# EAGLE design arduino_Uno_Rev3-02-TH (EAGLE 7.5.0)
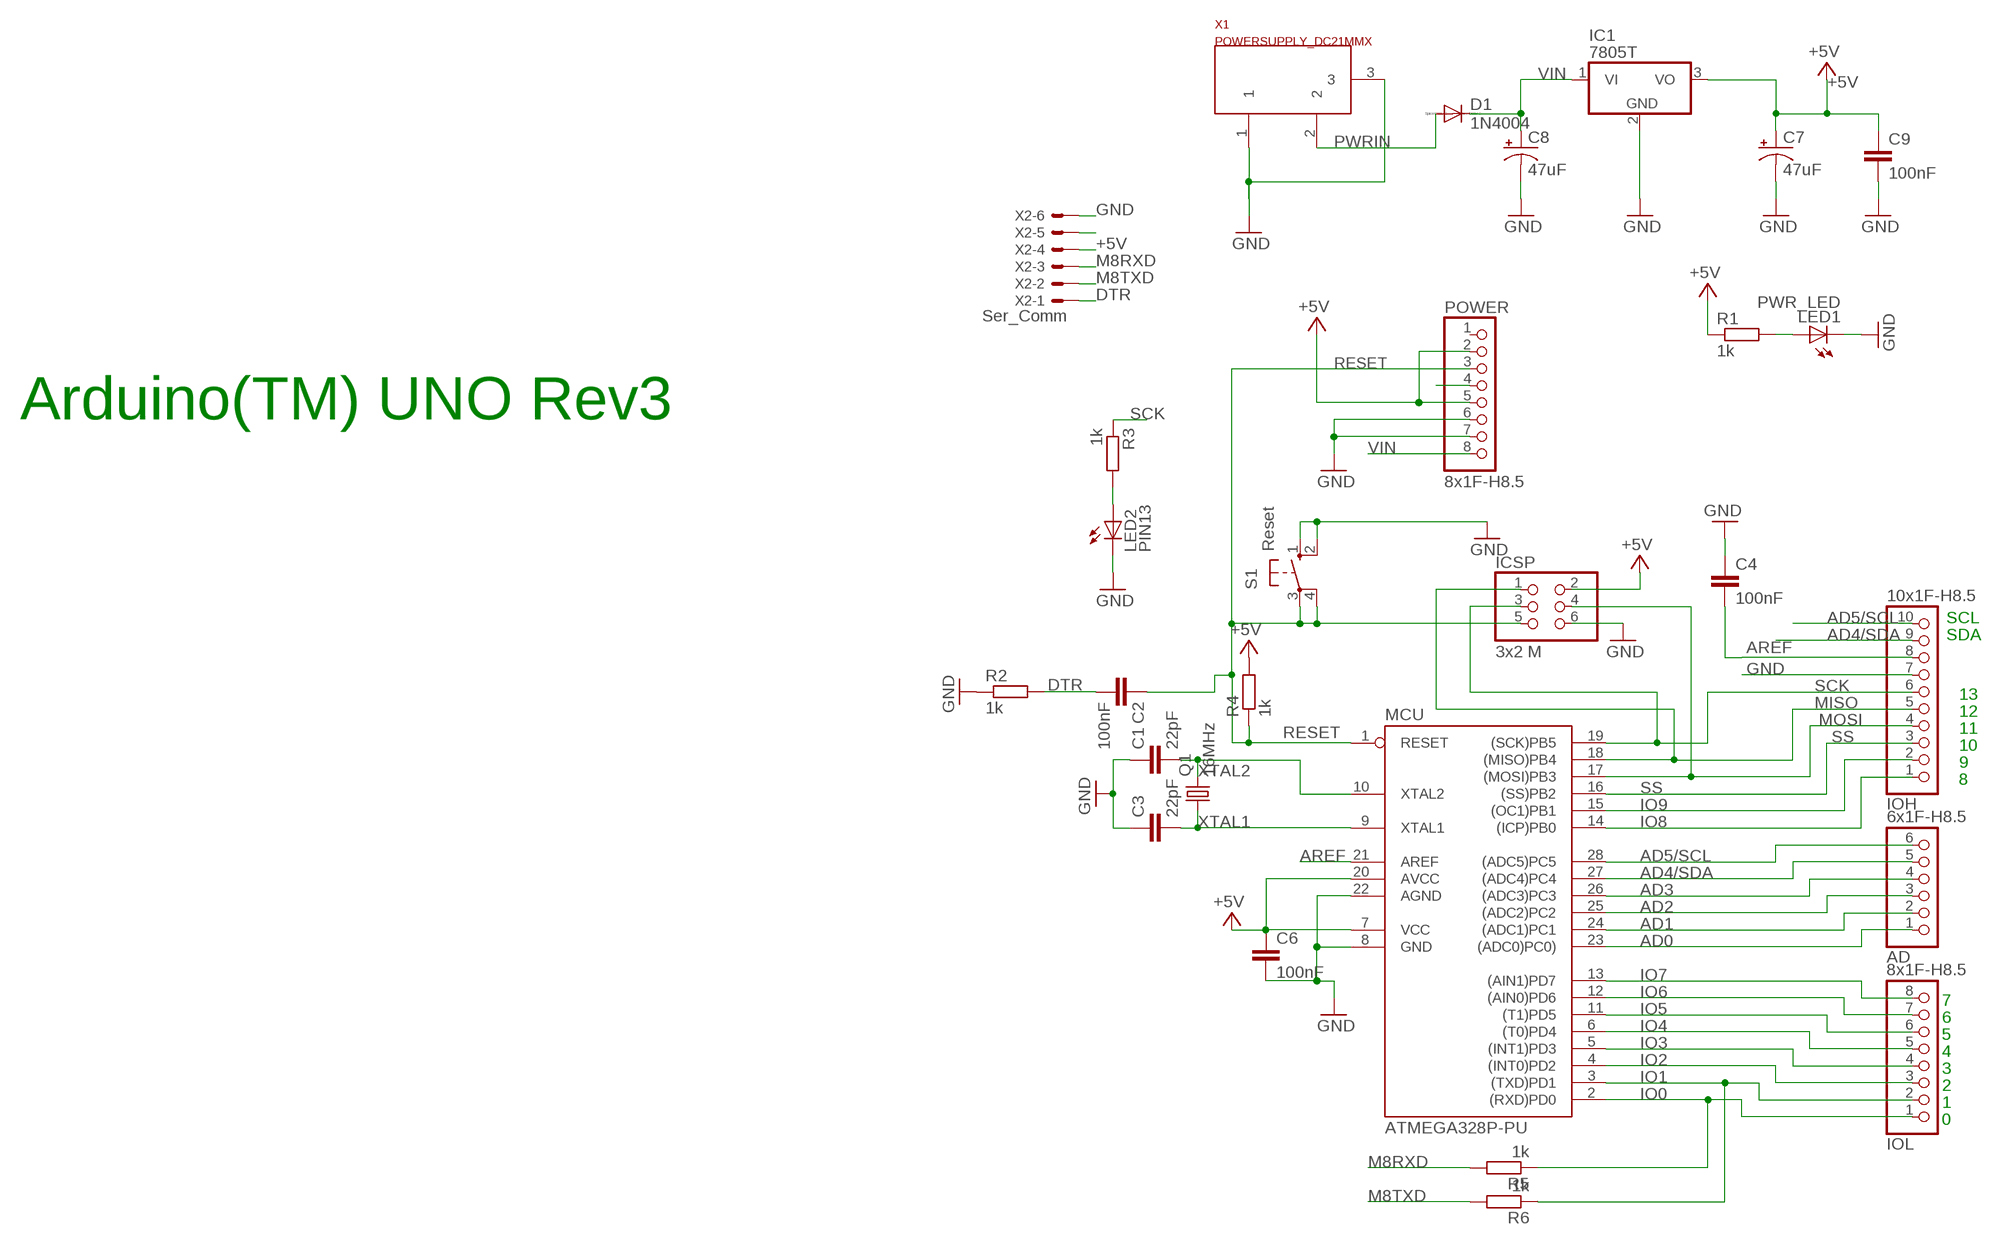
[diagram p0: schematic, sheet 1]

## Parts
AD  6x1F-H8.5  PINHD-1X6  [1X06]
C1  22pF  C2.5/2  [C2.5-2]
C2  100nF  C2,5-3  [C2.5-3]
C3  22pF  C2.5/2  [C2.5-2]
C4  100nF  C2,5-3  [C2.5-3]
C6  100nF  C2,5-3  [C2.5-3]
C7  47uF  CPOL-USE3.5-8  [E3,5-8]
C8  47uF  CPOL-USE3.5-8  [E3,5-8]
C9  100nF  C2,5-3  [C2.5-3]
D1  1N4004  [DO41-10]
IC1  7805T  [TO220H]
ICSP  3x2 M  PINHD-2X3  [2X03]
IOH  10x1F-H8.5  PINHD-1X10_ARD  [1X10]
IOL  8x1F-H8.5  PINHD-1X8  [1X08]
LED1  PWR_LED  LED3MM  [LED3MM]
LED2  PIN13  LED5MM  [LED5MM]
MCU  ATMEGA328P-PU  [DIL28-3]
POWER  8x1F-H8.5  PINHD-1X8  [1X08]
Q1  16MHz  CRYSTALHC49S  [HC49/S]
R1  1k  R-EU_0207/10  [0207/10]
R2  1k  R-EU_0207/10  [0207/10]
R3  1k  R-EU_0207/10  [0207/10]
R4  1k  R-EU_0207/10  [0207/10]
R5  1k  R-EU_0207/10  [0207/10]
R6  1k  R-EU_0207/10  [0207/10]
S1  Reset  10-XX  [B3F-10XX]
X1  POWERSUPPLY_DC21MMX  [POWERSUPPLY_DC-21MM]
X2  Ser_Comm  22-23-2061  [22-23-2061]

## Nets
+5V [usbvcc]: C6.1 C7.+ C9.1 IC1.3(VO) ICSP.2 MCU.7(VCC) MCU.20(AVCC) POWER.2 POWER.5 R1.1 R4.2 X2.4
AD0: AD.1 MCU.23((ADC0)PC0))
AD1: AD.2 MCU.24((ADC1)PC1)
AD2: AD.3 MCU.25((ADC2)PC2)
AD3: AD.4 MCU.26((ADC3)PC3)
AD4/SDA: AD.5 IOH.9 MCU.27((ADC4)PC4)
AD5/SCL: AD.6 IOH.10 MCU.28((ADC5)PC5)
AREF [aref]: C4.2 IOH.8 MCU.21(AREF)
DTR: C2.2 R2.2 X2.1
GND [gnd]: C1.1 C3.1 C4.1 C6.2 C7.- C8.- C9.2 IC1.2(GND) ICSP.6 IOH.7 LED1.K(C) LED2.K(C) MCU.8(GND) MCU.22(AGND) POWER.6 POWER.7 R2.1 S1.1(S) S1.2(S1) X1.1 X1.3 X2.6
IO0: IOL.1 MCU.2((RXD)PD0) R5.1
IO1: IOL.2 MCU.3((TXD)PD1) R6.1
IO2: IOL.3 MCU.4((INT0)PD2)
IO3: IOL.4 MCU.5((INT1)PD3)
IO4: IOL.5 MCU.6((T0)PD4)
IO5: IOL.6 MCU.11((T1)PD5)
IO6: IOL.7 MCU.12((AIN0)PD6)
IO7: IOL.8 MCU.13((AIN1)PD7)
IO8: IOH.1 MCU.14((ICP)PB0)
IO9: IOH.2 MCU.15((OC1)PB1)
M8RXD: R5.2 X2.3
M8TXD: R6.2 X2.2
MISO: ICSP.1 IOH.5 MCU.18((MISO)PB4)
MOSI: ICSP.4 IOH.4 MCU.17((MOSI)PB3)
N$1: POWER.4
N$2: LED2.A R3.2
N$3: LED1.A R1.2
N$8: X2.5
PWRIN [power]: D1.A X1.2
RESET: C2.1 ICSP.5 MCU.1(RESET) POWER.3 R4.1 S1.3(P) S1.4(P1)
SCK: ICSP.3 IOH.6 MCU.19((SCK)PB5) R3.1
SS: IOH.3 MCU.16((SS)PB2)
VIN [power]: C8.+ D1.C IC1.1(VI) POWER.8
XTAL1: C3.2 MCU.9(XTAL1) Q1.1
XTAL2: C1.2 MCU.10(XTAL2) Q1.2
Unconnected: POWER.1

## Notes on the sheet
- Arduino(TM) UNO Rev3
- SCL
- SDA
- 13
- 12
- 11
- 10
- 9
- 8
- 7
- 6
- 5
- 4
- 3
- 2
- 1
- 0

## Library data of the parts
AD = SmartPrj:PINHD-1X6: PIN HEADER
C1-C4 C6 C9 = capacitor-wima:C: CAPACITOR naming: grid - package width
C7 C8 = rcl:CPOL-US: POLARIZED CAPACITOR, American symbol
D1 = diode:1N4004: DIODE general purpose rectifier, 1 A
IC1 = linear:78*: Positive VOLTAGE REGULATOR Source: http://cache.national.com/ds/LM/LM78L05.pdf http://www.fairchildsemi.com/ds/LM/LM7805.pdf
ICSP = SmartPrj:PINHD-2X3: PIN HEADER
IOH = SmartPrj:PINHD-1X10_ARD: PIN HEADER
IOL POWER = SmartPrj:PINHD-1X8: PIN HEADER
LED1 LED2 = led:LED: LED OSRAM: - CHIPLED LG R971, LG N971, LY N971, LG Q971, LY Q971, LO R971, LY R971 LH N974, LH R974 LS Q976, LO Q976, LY Q976 LO Q996 - Hyper CHIPLED LW Q18S LB Q993, LB Q99A, LB R99A - SideLED LS A670, LO A670, LY A670, LG A670, LP A670 LB A673, LV A673, LT A673, LW A673 LH A674 LY A675 LS A676, LA A676, LO A676, LY A676, LW A676 LS A679, LY A679, LG A679 - Hyper Micro SIDELED® LS Y876, LA Y876, LO Y876, LY Y876 LT Y87S - SmartLED LW L88C, LW L88S LB L89C, LB L89S, LG L890 LS L89K, LO L89K, LY L89K LS L896, LA L896, LO L896, LY L896 - TOPLED LS T670, LO T670, LY T670, LG T670, LP T670 LSG T670, LSP T670, LSY T670, LOP T670, LYG T670 LG T671, LOG T671, LSG T671 LB T673, LV T673, LT T673, LW T673 LH T674 LS T676, LA T676, LO T676, LY T676, LB T676, LH T676, LSB T676, LW T676 LB T67C, LV T67C, LT T67C, LS T67K, LO T67K, LY T67K, LW E67C LS E67B, LA E67B, LO E67B, LY E67B, LB E67C, LV E67C, LT E67C LW T67C LS T679, LY T679, LG T679 LS T770, LO T770, LY T770, LG T770, LP T770 LB T773, LV T773, LT T773, LW T773 LH T774 LS E675, LA E675, LY E675, LS T675 LS T776, LA T776, LO T776, LY T776, LB T776 LHGB T686 LT T68C, LB T68C - Hyper Mini TOPLED® LB M676 - Mini TOPLED Santana® LG M470 LS M47K, LO M47K, LY M47K Source: http://www.osram.convergy.de LUXEON: - LUMILED® LXK2-PW12-R00, LXK2-PW12-S00, LXK2-PW14-U00, LXK2-PW14-V00 LXK2-PM12-R00, LXK2-PM12-S00, LXK2-PM14-U00 LXK2-PE12-Q00, LXK2-PE12-R00, LXK2-PE12-S00, LXK2-PE14-T00, LXK2-PE14-U00 LXK2-PB12-K00, LXK2-PB12-L00, LXK2-PB12-M00, LXK2-PB14-N00, LXK2-PB14-P00, LXK2-PB14-Q00 LXK2-PR12-L00, LXK2-PR12-M00, LXK2-PR14-Q00, LXK2-PR14-R00 LXK2-PD12-Q00, LXK2-PD12-R00, LXK2-PD12-S00 LXK2-PH12-R00, LXK2-PH12-S00 LXK2-PL12-P00, LXK2-PL12-Q00, LXK2-PL12-R00 Source: www.luxeon.com KINGBRIGHT: KA-3528ASYC Source: www.kingbright.com
MCU = SmartPrj:ATMEGA328P-: MICROCONTROLLER 4 Kbytes FLASH 128 bytes SRAM 256 bytes EEPROM UART 6-channel 10 bit ADC
Q1 = crystal:CRYSTAL: CRYSTAL; OC_FARNELL: 1667008; OC_NEWARK: unknown
R1-R6 = rcl:R-EU_: RESISTOR, European symbol
S1 = switch-omron:10-XX: OMRON SWITCH; MPN: B3F-1000; OC_FARNELL: 176432; OC_NEWARK: 36M3542
X1 = SmartPrj:POWERSUPPLY_DC21MM
X2 = con-molex:22-23-2061: .100" (2.54mm) Center Header - 6 Pin; MF: MOLEX; MPN: 22-23-2061; OC_FARNELL: 1462922; OC_NEWARK: 27C1933

## Net classes
0 default: width 0.254 mm, clearance 0.254 mm
1 power: width 0.61 mm, drill 0.61 mm, clearance 0.254 mm
2 gnd: width 0.305 mm, drill 0.559 mm, clearance 0.254 mm
3 usbvcc: width 0.508 mm, drill 0.61 mm, clearance 0.254 mm
4 aref: width 0.406 mm, drill 0.61 mm, clearance 0.254 mm

## Board
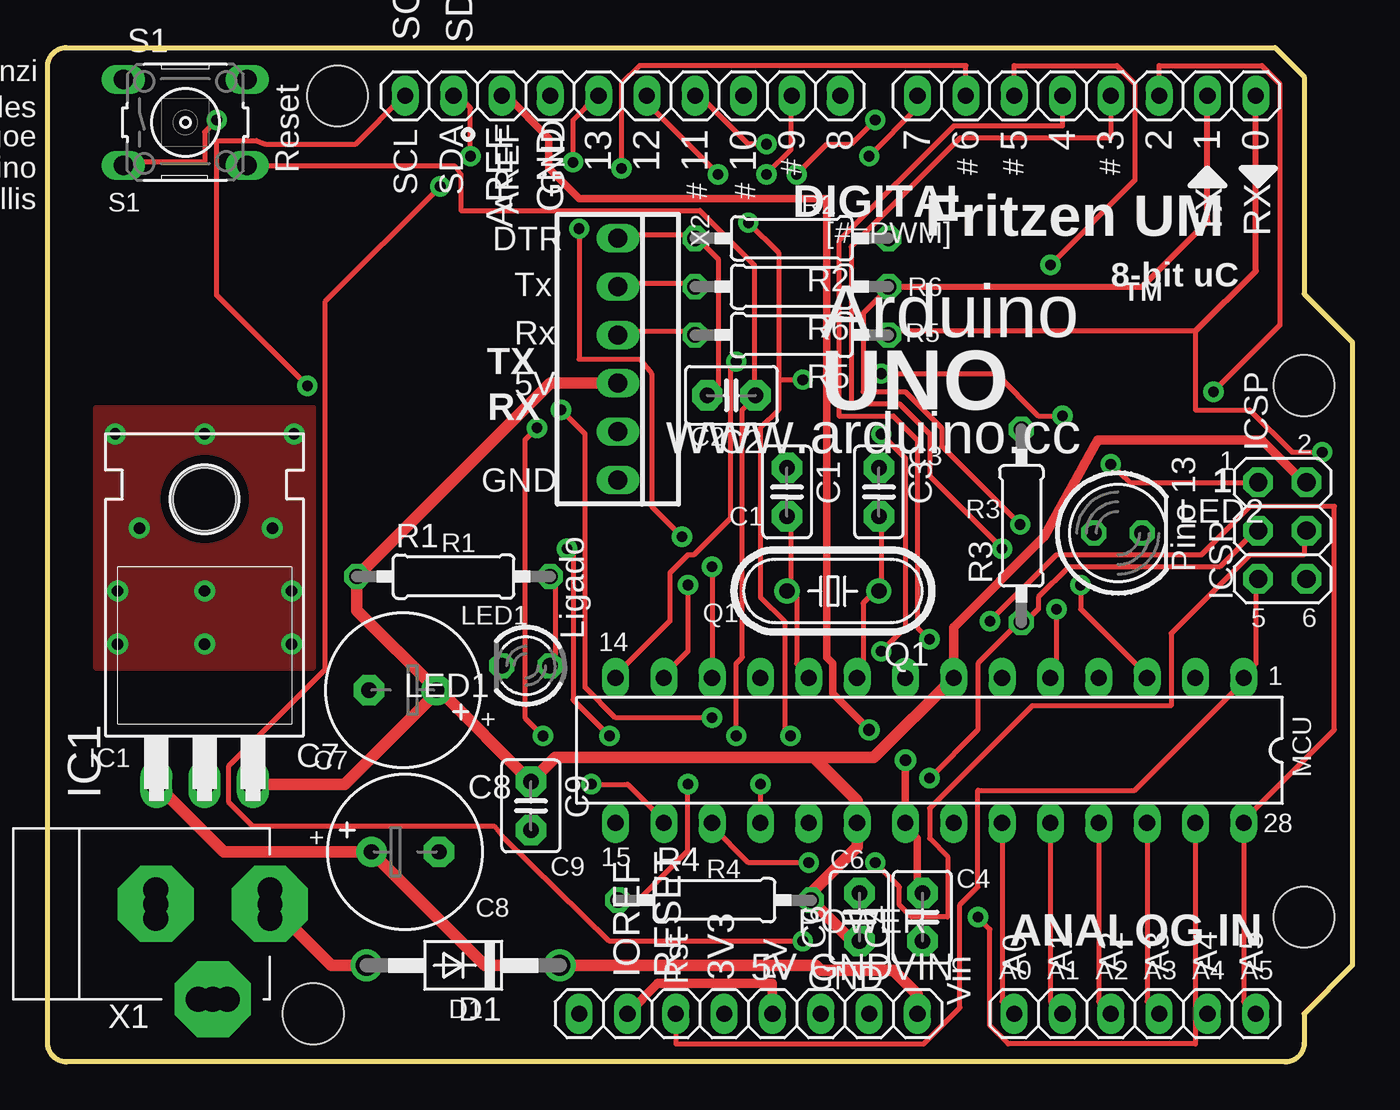
[diagram p1: board, top side]
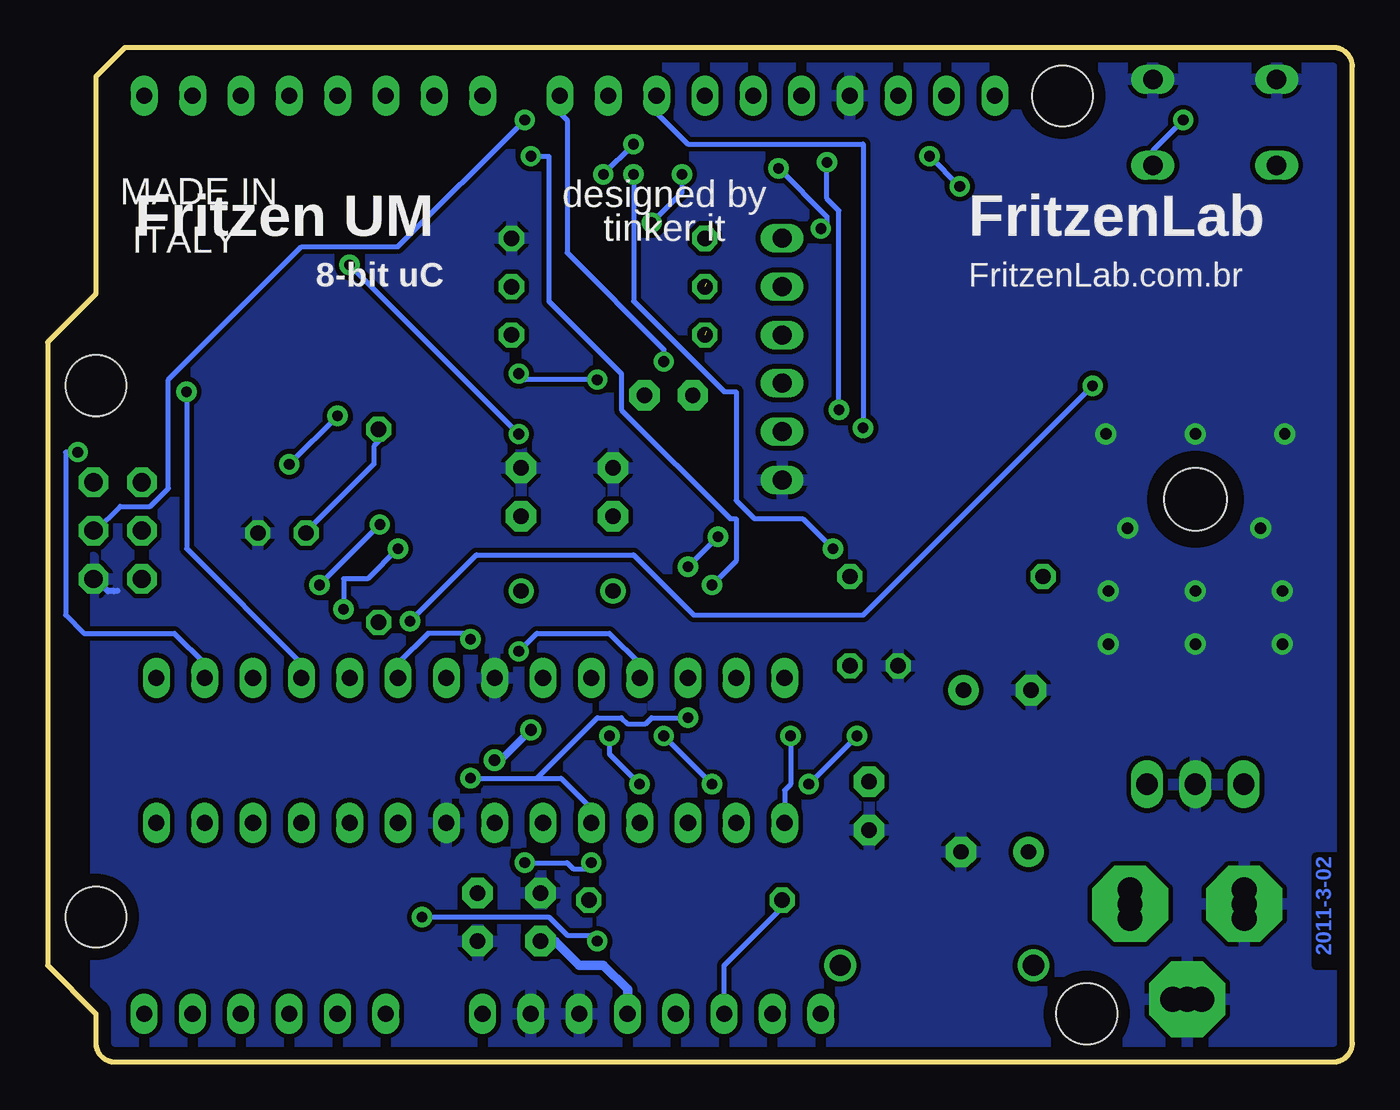
[diagram p2: board, bottom side, seen from below]

Size 68.58 x 53.34 mm. Coordinates in mm from the lower left corner, seen from the top.
Outline: 64.52,53.34 66.04,51.82 66.04,40.39 68.58,37.85 68.58,5.08 66.04,2.54 66.04,1 arc-90 65.04,0 1,0 arc-90 0,1 0,52.34 arc-90 1,53.34 64.52,53.34
Copper layers (1*16): Top 0.035mm / dielectric 1.5mm / Bottom 0.035mm
Design rules "default *": minimum track width 10mil, minimum drill 22mil, track to track 10mil, track to pad 10mil, pad to pad 10mil, via to via 10mil, smd to smd 8mil, copper to edge 26mil, drill to drill 10mil, minimum pad ring 10mil, minimum via ring 10mil, stop-mask expansion 1mil, vias tented up to drill 30mil, thermal gap 10mil
Holes 3.2 mm at 66.04,35.56 66.04,7.62 15.24,50.8 13.97,2.54
vRestrict: area 22.9,44.1 to 24.6,49.1; area 25.4,45.5 to 27.1,49.1; area 28.4,45.3 to 29.6,48.8; area 31,45.3 to 32.1,48.8; area 33.5,45.3 to 34.7,48.8; area 36.1,45.3 to 37.2,48.8; area 38.7,47.2 to 39.9,48.8; area 40.3,45.1 to 47.6,46.9; area 60.3,44.2 to 61.7,46.7; area 62.9,44.2 to 64.3,46.7; area 61.3,35.8 to 64.8,37.2; area 0.6,21.8 to 2,30.1; 14 more areas

### Footprints (pad centres in the part's own frame; a part is rotated, then mirrored left to right if it is on the bottom)
1X06 = drill 0.85 pad 1.422 long: 1 -6.35,0; 2 -3.81,0; 3 -1.27,0; 4 1.27,0; 5 3.81,0; 6 6.35,0
C2.5-2 = drill 0.813 pad 1.6 octagon: 1 -1.27,0; 2 1.27,0
C2.5-3 = drill 0.813 pad 1.6 octagon: 1 -1.27,0; 2 1.27,0
E3,5-8 = drill 0.813 pad 1.6: + -1.778,0 | drill 0.813 pad 1.6 octagon: - 1.778,0
DO41-10 = drill 1.118: A 5.08,0; C -5.08,0
TO220H = drill 1.118 long: 1 -2.54,-10.16; 2 0,-10.16; 3 2.54,-10.16 | hole 3.302: 0,4.826
2X03 = drill 0.95 pad 1.55 octagon: 1 -2.54,-1.27; 2 -2.54,1.27; 3 0,-1.27; 4 0,1.27; 5 2.54,-1.27; 6 2.54,1.27
1X10 = drill 0.85 pad 1.422 long: 1 -11.43,0; 2 -8.89,0; 3 -6.35,0; 4 -3.81,0; 5 -1.27,0; 6 1.27,0; 7 3.81,0; 8 6.35,0; 9 8.89,0; 10 11.43,0
1X08 = drill 0.85 pad 1.422 long: 1 -8.89,0; 2 -6.35,0; 3 -3.81,0; 4 -1.27,0; 5 1.27,0; 6 3.81,0; 7 6.35,0; 8 8.89,0
LED3MM = drill 0.813 octagon: A -1.27,0; K 1.27,0
LED5MM = drill 0.813 octagon: A -1.27,0; K 1.27,0
DIL28-3 = drill 0.85 pad 1.422 long: 1 -16.51,-3.81; 2 -13.97,-3.81; 3 -11.43,-3.81; 4 -8.89,-3.81; 5 -6.35,-3.81; 6 -3.81,-3.81; 7 -1.27,-3.81; 8 1.27,-3.81; 9 3.81,-3.81; 10 6.35,-3.81; 11 8.89,-3.81; 12 11.43,-3.81; 13 13.97,-3.81; 14 16.51,-3.81; 15 16.51,3.81; 16 13.97,3.81; 17 11.43,3.81; 18 8.89,3.81; 19 6.35,3.81; 20 3.81,3.81; 21 1.27,3.81; 22 -1.27,3.81; 23 -3.81,3.81; 24 -6.35,3.81; 25 -8.89,3.81; 26 -11.43,3.81; 27 -13.97,3.81; 28 -16.51,3.81
HC49/S = drill 0.813: 1 -2.413,0; 2 2.413,0
0207/10 = drill 0.813 octagon: 1 -5.08,0; 2 5.08,0
B3F-10XX = drill 1.016 long: 1 -3.251,2.261; 2 3.251,2.261; 3 -3.251,-2.261; 4 3.251,-2.261
POWERSUPPLY_DC-21MM = drill 1.3 pad 4 octagon: 1 -5.08,-3.353; 2 -0.076,-6.35; 3 -0.076,-0.356 | drill 1.3: 4 -5.08,-4.115; 5 -5.08,-2.591; 6 -0.838,-0.356; 7 0.686,-0.356; 8 -0.838,-6.35; 9 0.686,-6.35
22-23-2061 = drill 1 long: 1 -6.35,0; 2 -3.81,0; 3 -1.27,0; 4 1.27,0; 5 3.81,0; 6 6.35,0

### Placement (x,y rotation side)
AD  57.15,2.54 0 top
C1  38.86,29.97 270 top
C2  35.94,35.05 180 top
C3  43.69,29.97 270 top
C4  45.97,7.62 90 top
C6  42.67,7.62 90 top
C7  18.67,19.56 180 top
C8  18.8,11.05 0 top
C9  25.4,13.46 270 top
D1  21.84,5.08 180 top
IC1  8.26,24.77 0 top
ICSP  64.9,27.94 270 top
IOH  30.23,50.8 180 top
IOL  54.61,50.8 180 top
LED1  25.15,20.83 180 top
LED2  56.26,27.81 0 top
MCU  46.35,16.38 180 top
POWER  36.83,2.54 0 top
Q1  41.27,24.77 180 top
R1  21.34,25.53 0 top
R2  39.12,43.31 180 top
R3  51.18,28.19 90 top
R4  35.05,8.51 0 top
R5  39.12,38.23 180 top
R6  39.12,40.77 180 top
S1  7.24,49.4 0 top
X1  5.33,8.38 90 top
X2  29.97,36.96 270 top

### Tracks (layer width: path | path; a pad name or v marks a point on that pad's centre or on a via)
+5V
  Top 0.508: POWER.2 32.07,4.13 38.1,4.13 POWER.5 | MCU.7 47.62,22.86 52.39,27.62 55.18,32.7 63.82,32.7 66.04,30.48 ICSP.2
  Top 0.61: IC1.3 15.62,14.61 20.45,19.43 C7.+ | C7.+ 16.26,23.75 R1.1 26.42,35.69 X2.4 | C7.+ 20.57,19.56 C9.1 26.67,16 40.26,16 | 40.26,16 42.55,13.72 MCU.20 42.55,11.3 40.13,8.89 R4.2 42.29,6.35 C6.1 | MCU.7 43.43,16 40.26,16
  Bottom 0.508: POWER.5 38.1,3.81 39.37,5.08 40.64,5.08 41.91,6.35 C6.1
AD0
  Top 0.254: AD.1 50.16,3.17 MCU.23
AD1
  Top 0.254: AD.2 52.7,3.17 MCU.24
AD2
  Top 0.254: AD.3 55.24,3.17 MCU.25
AD3
  Top 0.254: AD.4 57.78,3.17 MCU.26
AD4/SDA  (via drill 0.56)
  Top 0.254: MCU.27 60.33,3.17 | v22.23,47.62 22.23,50.16 21.59,50.8 IOH.9 | v20.64,46.04 14.61,40.01 14.61,20.64 9.53,15.56 9.53,13.65 10.79,12.38 23.5,12.38 24,11.75 29.53,6.35 v39.69,6.35 | v48.9,7.62 49.53,6.99 49.53,1.91 50.48,0.95 60.33,0.95 60.33,3.17 | 60.33,3.17 AD.5
  Bottom 0.254: v20.64,46.04 v22.23,47.62 | v39.69,6.35 40.01,6.67 41.27,6.67 42.23,7.62 v48.9,7.62
AD5/SCL  (via drill 0.56)
  Top 0.254: AD.6 62.87,3.17 MCU.28 62.87,12.7 67.63,17.46 67.63,29.21 63.18,29.21 60.64,26.67 53.02,26.67 v49.53,23.18 | v13.65,35.56 8.89,40.32 8.89,48.45 10.99,48.45 11.43,48.26 16.19,48.26 18.73,50.8 IOH.10
  Bottom 0.254: v13.65,35.56 25.72,23.5 34.61,23.5 37.78,26.67 46.04,26.67 v49.53,23.18
AREF  (via drill 0.61)
  Top 0.406: C4.2 45.72,8.89 45.72,11.75 45.09,12.38 MCU.21 v45.09,15.88 | v43.18,17.46 41.27,19.37 41.27,20.95 40.96,21.27 40.96,45.4 27.94,45.4 26.35,46.99 26.35,48.58 24.13,50.8 IOH.8
  Bottom 0.406: v43.18,17.46 44.77,15.88 v45.09,15.88
DTR
  Top 0.254: X2.1 30.16,43.5 33.97,43.5 R2.2 34.29,43.18 35.24,42.23 35.24,35.56 34.92,35.24 C2.2
GND  (via drill 0.6)
  Bottom 0.305: ICSP.6 66.04,25.4 65.41,24.77 65.09,24.77 64.9,24.78
  other vias: 8.26,21.97 12.83,21.97 3.68,21.97 3.68,24.77 8.26,24.77 12.83,24.77 11.81,28.07 4.83,28.07 12.95,33.02 8.26,33.02 3.56,33.02
  pour Bottom: 0,53.34 66.04,53.34 66.04,39.24 66.04,22.23 66.04,4.95 66.04,0.13 55.63,0.13 42.55,0.13 31.11,0.13 19.18,0.13 9.78,0.13 0,0.13 0,0.89 0,12.06 0,21.84 0,30.99 0,38.35 0,47.12
  pour Top: 13.97,20.7 2.54,20.7 2.54,30.73 2.54,34.42 13.97,34.42 13.97,33.02 13.97,23.88
IO0  (via drill 0.56)
  Top 0.254: R5.1 44.45,38.42 60.33,38.42 60.33,34.29 63.18,34.29 65.41,32.07 v66.99,32.07
  Top 0.305: 60.33,38.42 63.5,41.59 IOL.1
  Bottom 0.254: MCU.2 60.33,20.95 61.91,22.54 66.67,22.54 67.63,23.5 67.63,32.07 v66.99,32.07
IO1  (via drill 0.56)
  Top 0.254: v54.29,25.08 54.29,23.81 57.78,20.32 MCU.3 | v51.12,28.26 46.99,32.38 46.99,33.34 45.09,35.24 42.86,35.24 42.86,39.37 44.13,40.64 R6.1
  Top 0.305: R6.1 57.53,40.77 60.96,44.2 IOL.2
  Bottom 0.254: v51.12,28.26 v54.29,25.08
IO2  (via drill 0.56)
  Top 0.254: v61.28,35.24 64.77,38.73 64.77,51.44 63.82,52.39 58.42,52.39 IOL.3
  Bottom 0.254: MCU.4 55.24,20.95 61.28,26.99 v61.28,35.24
IO3  (via drill 0.56)
  Top 0.254: v53.02,23.81 53.02,20.64 52.7,20.32 MCU.5 | v50.16,26.99 46.35,30.8 46.35,33.02 44.77,34.61 42.23,34.61 42.23,42.86 47.94,48.58 55.88,48.58 IOL.4
  Bottom 0.254: v53.02,23.81 53.02,25.4 51.75,25.4 v50.16,26.99
IO4  (via drill 0.56)
  Top 0.254: v46.35,22.23 45.72,22.86 45.72,32.7 44.45,33.97 41.59,33.97 41.59,43.18 47.62,49.21 53.34,49.21 IOL.5
  Bottom 0.254: MCU.6 50.16,20.95 48.58,22.54 46.67,22.54 v46.35,22.23
IO5  (via drill 0.56)
  Top 0.254: v43.81,21.59 45.09,22.86 45.09,31.75 v43.81,33.02 | v52.7,41.91 57.15,46.35 57.15,51.44 56.2,52.39 50.8,52.39 IOL.6
  Bottom 0.254: MCU.11 37.47,20.95 39.05,22.54 42.86,22.54 v43.81,21.59 | v52.7,41.91 v43.81,33.02
IO6  (via drill 0.56)
  Top 0.254: v34.92,26.04 MCU.12 | v33.34,27.62 31.75,29.21 31.75,36.2 31.11,36.96 27.94,36.96 v27.94,43.81 | v30.16,46.99 30.16,51.44 31.11,52.39 48.26,52.39 IOL.7
  Bottom 0.254: v33.34,27.62 v34.92,26.04 | v27.94,43.81 27.62,44.13 27.62,44.45 v30.16,46.99
IO7  (via drill 0.56)
  Top 0.254: v33.66,25.08 33.66,21.59 32.38,20.32 MCU.13 | v43.18,47.62 45.72,50.16 IOL.8
  Bottom 0.254: v33.66,25.08 32.38,26.35 32.38,28.57 32.7,28.57 38.42,34.29 38.42,36.2 42.23,40.01 42.23,47.62 v43.18,47.62
IO8  (via drill 0.56)
  Top 0.254: v36.2,36.83 35.88,36.51 35.88,28.57 33.97,26.67 33.66,26.67 32.7,25.72 32.7,23.18 29.84,20.32 MCU.14
  Bottom 0.254: v36.2,36.83 36.2,37.47 41.27,42.55 41.27,49.53 41.59,49.85 41.59,50.8 IOH.1
IO9  (via drill 0.56)
  Top 0.254: v29.53,17.14 27.62,19.05 27.62,26.67 v27.3,26.99 | v37.78,46.67 39.05,47.94 39.05,50.8 IOH.2
  Bottom 0.254: MCU.15 29.84,14.29 29.53,14.61 v29.53,17.14 | v27.3,26.99 28.89,28.57 31.43,28.57 32.38,29.53 32.38,35.24 33.02,35.24 37.78,40.01 v37.78,46.67
M8RXD  (1 unrouted)
  Top 0.254: 33.97,38.42 30.16,38.42 X2.3
M8TXD  (1 unrouted)
  Top 0.254: 33.97,40.96 30.16,40.96 X2.2
MISO  (via drill 0.56)
  Top 0.254: v37.47,14.61 MCU.18 | v39.05,17.14 38.73,17.46 38.73,23.18 37.47,24.45 37.47,33.34 38.42,34.29 38.42,35.88 | 38.42,35.88 38.42,42.55 v36.83,44.13 | v35.24,46.67 31.75,50.16 31.75,50.8 IOH.5 | ICSP.1 56.9,30.48 v55.88,31.43 | v53.34,33.97 52.07,33.97 49.85,36.2 v43.81,36.2 | 38.42,35.88 v39.69,35.88
  Bottom 0.254: v37.47,14.61 39.05,16.19 v39.05,17.14 | v36.83,44.13 35.24,45.72 v35.24,46.67 | v53.34,33.97 v55.88,31.43 | v43.81,36.2 43.5,35.88 v39.69,35.88
MOSI  (via drill 0.56)
  Top 0.254: v40.01,10.48 36.83,10.48 34.92,12.38 MCU.17 | v43.5,10.48 44.77,9.21 44.77,8.26 45.4,7.62 47.31,7.62 47.31,10.79 46.35,11.75 46.35,13.34 51.75,18.73 59.05,18.73 59.05,22.54 63.18,26.67 66.04,26.67 66.04,27.94 ICSP.4 | v37.78,48.26 36.83,48.26 34.29,50.8 IOH.4 | v43.5,49.53 42.23,48.26 40.96,48.26 v39.37,46.67
  Bottom 0.254: v40.01,10.48 40.32,10.16 40.96,10.16 41.27,10.48 v43.5,10.48 | v39.37,46.67 v37.78,48.26 | v43.5,49.53 50.16,42.86 55.24,42.86 62.23,35.88 62.23,30.16 63.18,29.21 64.77,29.21 66.04,27.94 ICSP.4
N$2
  Bottom 0.254: LED2.A 54.93,27.94 51.44,31.43 51.44,32.38 50.8,33.02 50.8,33.34 51.12,33.34 R3.2
N$3
  Top 0.254: LED1.A 26.67,20.95 26.67,25.4 R1.2
PWRIN
  Top 0.61: X1.2 14.91,5.08 D1.A
RESET  (via drill 0.56)
  Top 0.254: v8.89,49.53 8.26,48.9 8.26,47.31 4.13,47.31 S1.3 | S1.4 10.79,47.12 21.4,47.12 21.72,46.67 21.72,44.77 34.29,44.77 37.15,41.91 37.15,35.24 C2.1 37.15,34.92 36.51,34.29 36.51,21.27 36.2,20.95 v36.2,17.14 | ICSP.5 63.5,25.4 63.5,20.95 62.87,20.32 MCU.1 62.87,20 57.15,14.29 48.9,14.29 48.9,9.21 47.94,8.26 47.94,2.86 46.04,0.95 33.02,0.95 POWER.3 | v33.66,14.61 33.66,11.11 31.05,8.51 R4.1
  Bottom 0.254: v8.89,49.53 10.48,47.94 10.48,47.31 S1.4 | POWER.3 33.02,5.08 29.97,8.13 R4.1 | v33.66,14.61 v36.2,17.14
SCK  (via drill 0.56)
  Top 0.254: ICSP.3 63.5,27.94 61.59,26.04 53.66,26.04 52.07,24.45 52.07,23.81 51.44,23.18 R3.1 51.12,23.18 48.9,20.95 48.9,17.46 v46.35,14.92 | v27.62,47.31 27.62,49.53 28.89,50.8 IOH.6 | v26.99,34.29 28.26,33.02 28.26,19.68 29.84,18.1 v34.92,18.1
  Bottom 0.254: MCU.19 40.01,13.34 41.59,14.92 42.86,14.92 | v46.35,14.92 42.86,14.92 | v27.62,47.31 27.62,45.4 26.99,44.77 v26.99,34.29 | v34.92,18.1 36.83,18.1 37.15,17.78 38.1,17.78 38.42,18.1 39.69,18.1 42.86,14.92
SS  (via drill 0.56)
  Top 0.254: v28.57,14.61 30.48,14.61 32.38,12.7 MCU.16 | v26.04,17.14 25.08,18.1 25.08,32.7 v25.72,33.34
  Bottom 0.254: v26.04,17.14 v28.57,14.61 | v25.72,33.34 25.72,48.26 34.92,48.26 36.51,49.85 36.51,50.8 IOH.3
VIN
  Top 0.61: POWER.8 45.72,3.56 44.45,4.83 40.64,4.83 40.39,5.08 D1.C 22.99,5.08 C8.+ 9.27,11.05 IC1.1
XTAL1
  Top 0.254: C3.2 43.81,28.57 43.81,24.77 Q1.1 43.5,24.77 42.86,24.13 42.86,20.64 42.55,20.32 MCU.9
XTAL2
  Top 0.254: 39.05,24.77 39.05,28.57 C1.2 | 39.05,24.77 39.37,24.45 39.37,20.95 40.01,20.32 MCU.10 | 39.05,24.77 Q1.2

### Text on the board
Bottom: 2011-3-02
tPlace: 13 | 12 | 11 | 10 | 9 | 8 | 7 | 6 | 5 | 4 | 3 | 2 | 1 | 0 | Reset | SCL | SDA | GND | S1 | AREF | R2 | DTR | Fritzen UM | 8-bit uC | Tx | R6 | Rx | R5 | ICSP | 5V | C2 | Pino 13 | 2 | GND | C3 | 1 | R3 | C1 | R1 | LED1 | Q1 | 5 | 6 | Ligado | 14 | 1 | + | IC1 | C7 | MCU | 28 | + | R4 | C6 | C9 | 15 | C4 | C8 | 5V | Vin | GND | A0 | A1 | A2 | A3 | A4 | A5 | Rst | X1 | D1
bPlace: FritzenLab | Fritzen UM | FritzenLab.com.br | 8-bit uC
tNames: SCL | SDA | M.Banzi | D.Cuartielles | T.Igoe | AREF | GND | G.Martino | # | # | # | # | D.Mellis | # | # | DIGITAL | [#=PWM] | TX | RX | TM | TX | Arduino | RX | UNO | www.arduino.cc | 1 | ANALOG IN | IOREF | RESET | 3V3 | 5V | GND | VIN | A0 | A1 | A2 | A3 | A4 | A5
bNames: MADE IN | designed by | MADE IN | ITALY | tinker it | ITALY | designed by | tinker it | ATMEGA328
ReferenceLC: L | TX | ON | RX | PC1 | PC2
214bmp: D:/SmartProjects/Snc/a4_bn_logo2.bmp